# Altium schematic sheet Sheet.SchDoc
size 420 x 297 mm
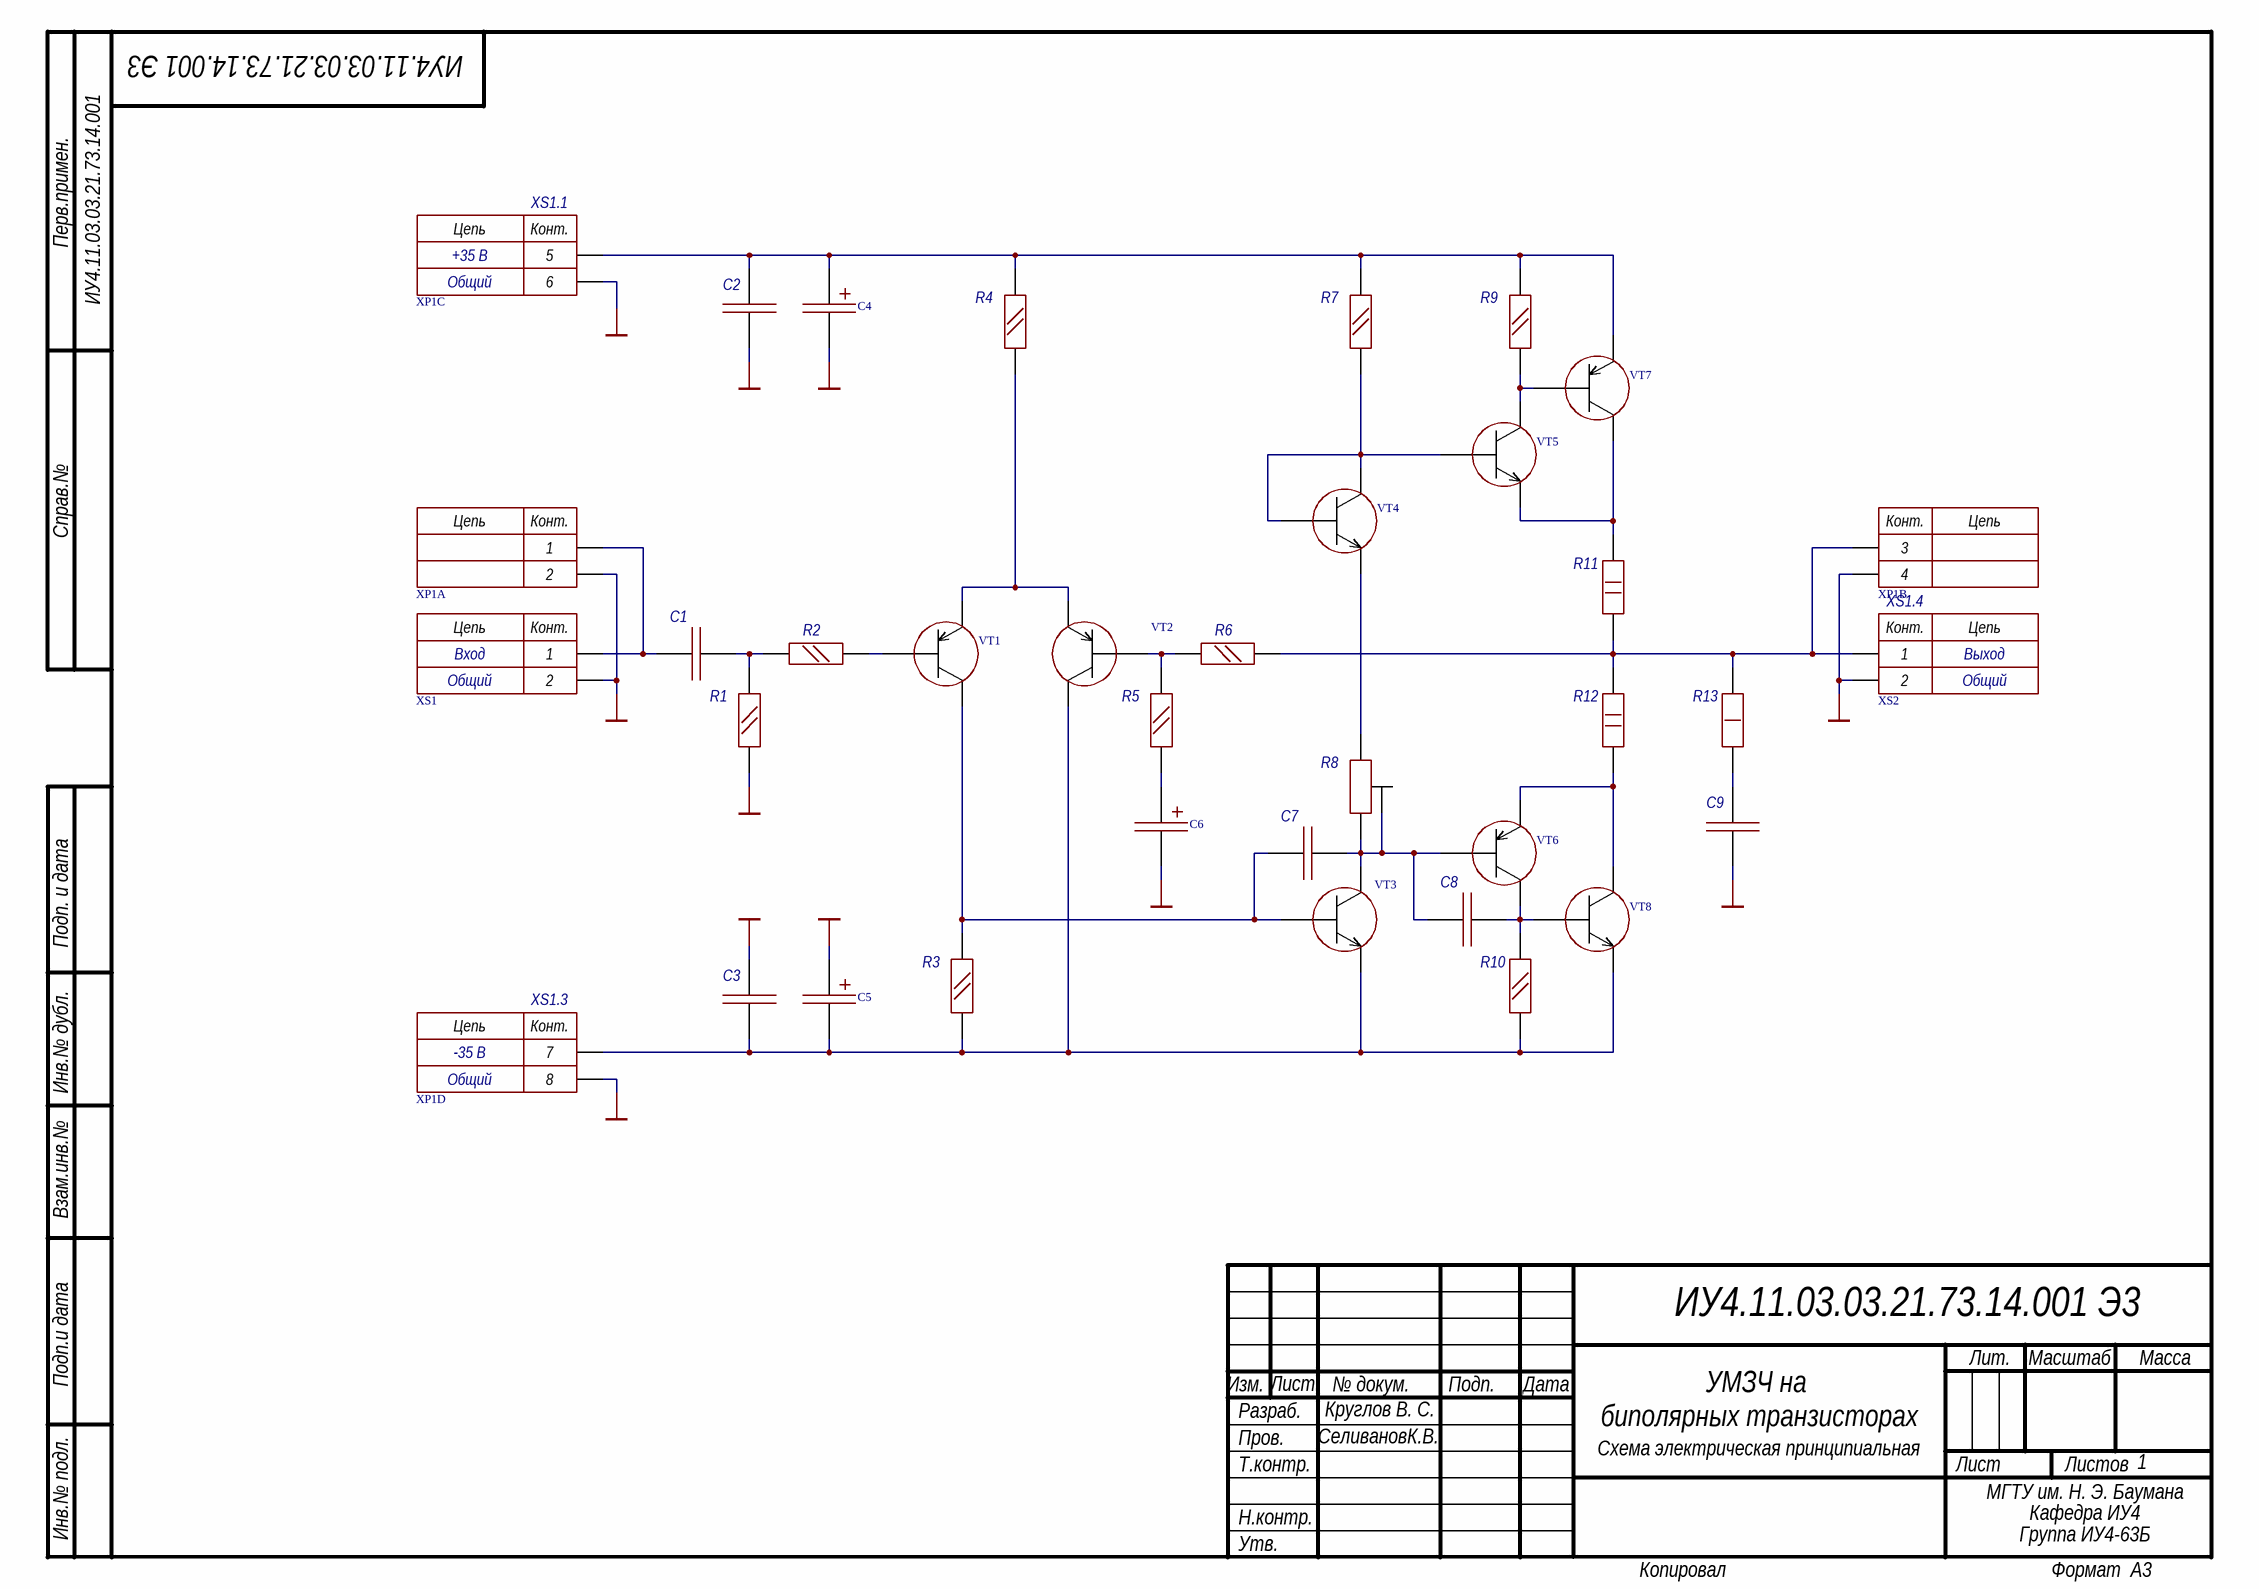
[diagram p0: Sheet.SchDoc]

## Parts
C1  Capacitor  [C_PLY_10X5]  (value not drawn)
C2  Capacitor  [C_PLY_10X5]  (value not drawn)
C3  Capacitor  [C_PLY_10X5]  (value not drawn)
C4  Capactor polar  [C_EL_12X25]  (value not drawn)
C5  Capactor polar  [C_EL_12X25]  (value not drawn)
C6  Capactor polar  [C_EL_4X7]  (value not drawn)
C7  Capacitor  [C_PLY_7X5]  (value not drawn)
C8  Capacitor  [C_PLY_7X5]  (value not drawn)
C9  Capacitor  [C_PLY_10X5]  (value not drawn)
R1  Res  [R0125W_AX025]  (value not drawn)
R2  Res  [R0125W_AX025]  (value not drawn)
R3  Res  [R0125W_AX025]  (value not drawn)
R4  Res  [R0125W_AX025]  (value not drawn)
R5  Res  [R0125W_AX025]  (value not drawn)
R6  Res  [R0125W_AX025]  (value not drawn)
R7  Res  [R0125W_AX025]  (value not drawn)
R8  POT  [POT_3296W]  (value not drawn)
R9  Res  [R0125W_AX025]  (value not drawn)
R10  Res  [R0125W_AX025]  (value not drawn)
R11  Res  [R2W_AX08]  (value not drawn)
R12  Res  [R2W_AX08]  (value not drawn)
R13  Res  [R1W_AX06]  (value not drawn)
VT1  Transistor_PNP  [TO92_3]  (value not drawn)
VT2  Transistor_PNP  [TO92_3]  (value not drawn)
VT3  BD139G  [TO220_3]  (value not drawn)
VT4  BD139G  [TO126_3]  (value not drawn)
VT5  BD139G  [TO126_3]  (value not drawn)
VT6  Transistor_PNP  [TO126_3]  (value not drawn)
VT7  Transistor_PNP  [TO247_3]  (value not drawn)
VT8  BD139G  [TO247_3]  (value not drawn)
XP1  CONN  [HDRR_F_2X4]  (value not drawn)  (parts A,B,C,D of 4)
XS1  Audio  [FP-NMJ4HFD2-MFG]  (value not drawn)
XS2  Audio  [FP-NMJ4HFD2-MFG]  (value not drawn)

## Nets
GND: C2.2 C3.2 C4.1 C5.2 C6.1 C9.2 R1.1 XP1.2 XP1.4 XP1.6 XP1.8 XS1.2 XS2.2
NetC1_1: C1.1 XP1.1 XS1.1
NetC1_2: C1.2 R1.2 R2.2
NetC2_1: C2.1 C4.2 R4.2 R7.2 R9.2 VT7.1(E) XP1.5
NetC3_1: C3.1 C5.1 R3.1 R10.1 VT2.2(C) VT3.1(E) VT8.1(E) XP1.7
NetC6_2: C6.2 R5.1
NetC7_1: C7.1 R3.2 VT1.2(C) VT3.3(B)
NetC7_2: C7.2 C8.1 R8.2 R8.3 VT3.2(C) VT6.3(B)
NetC8_2: C8.2 R10.2 VT6.2(C) VT8.3(B)
NetC9_1: C9.1 R13.1
NetR2_1: R2.1 VT1.3(B)
NetR4_1: R4.1 VT1.1(E) VT2.1(E)
NetR5_2: R5.2 R6.2 VT2.3(B)
NetR6_1: R6.1 R11.1 R12.2 R13.2 XP1.3 XS2.1
NetR7_1: R7.1 VT4.2(C) VT4.3(B) VT5.3(B)
NetR8_1: R8.1 VT4.1(E)
NetR9_1: R9.1 VT5.2(C) VT7.3(B)
NetR11_2: R11.2 VT5.1(E) VT7.2(C)
NetR12_1: R12.1 VT6.1(E) VT8.2(C)

## Notes on the sheet
- ИУ4.11.03.03.21.73.14.001 Э3
- ИУ4.11.03.03.21.73.14.001
- +35 В
- (near XP1) XS1.1
- Общий
- (near XP1) XS1.4
- Вход
- Выход
- (near XP1) XS1.3
- -35 В
- Круглов В. С.
- СеливановК.В.
- УМЗЧ на
  биполярных транзисторах
- Схема электрическая принципиальная
- 1
- МГТУ им. Н. Э. Баумана
- Кафедра ИУ4
- Группа ИУ4-63Б
- Перв.примен.
- Справ.№
- Подп. и дата
- Инв.№ дубл.
- Взам.инв.№
- Подп.и дата
- Разраб.
- Изм.
- Лист
- № докум.
- Подп.
- Дата
- Лит.
- Масштаб
- Масса
- Т.контр.
- Пров.
- Листов
- Инв.№ подл.
- Утв.
- Н.контр.
- Копировал
- Формат  A3
- (in symbol Audio) Конт.; Цепь
- (in symbol CONN, part A) Цепь; Конт.
- (in symbol CONN, part B) Конт.; Цепь
- (in symbol CONN, part C) Цепь; Конт.
- (in symbol CONN, part D) Цепь; Конт.

## Library data of the parts
VT3-VT5 VT8 = Transistor_NPN: NexarPartId: 354669; Manufacturer Lifecycle Status: ACTIVE; Collector Emitter Saturation Voltage: 500mV; Collector Emitter Breakdown Voltage: 80V; hFE Min: 25; Element Configuration: Single; Max Power Dissipation: 1.25W; Max Junction Temperature (Tj): 150°C; Emitter Base Voltage (VEBO): 5V; Max Collector Current: 1.5A; Number of Elements: 1; Polarity: NPN; Min Operating Temperature: -55°C; Max Operating Temperature: 150°C; Voltage Rating (DC): 80V; REACH SVHC: No SVHC; Radiation Hardening: No; Contact Plating: Tin; Schedule B: 8541290080, 8541290080|8541290080, 8541290080|8541290080|8541290080, 8541290080|8541290080|8541290080|8541290080; Number of Pins: 3; Case/Package: TO-225; Lifecycle Status: Production; Collector Base Voltage (VCBO): 80V; Weight: 4.535924g; Height: 11.04mm; RoHS: Compliant; Width: 2.66mm; Collector Emitter Voltage (VCEO): 80V; Lead Free: Lead Free; Current Rating: 1.5A; Power Dissipation: 1.25W; Packaging: Bulk; Length: 7.74mm